# Altium schematic sheet MCU_LORA.SchDoc
size A3; SheetNumber: 1; SheetTotal: 1
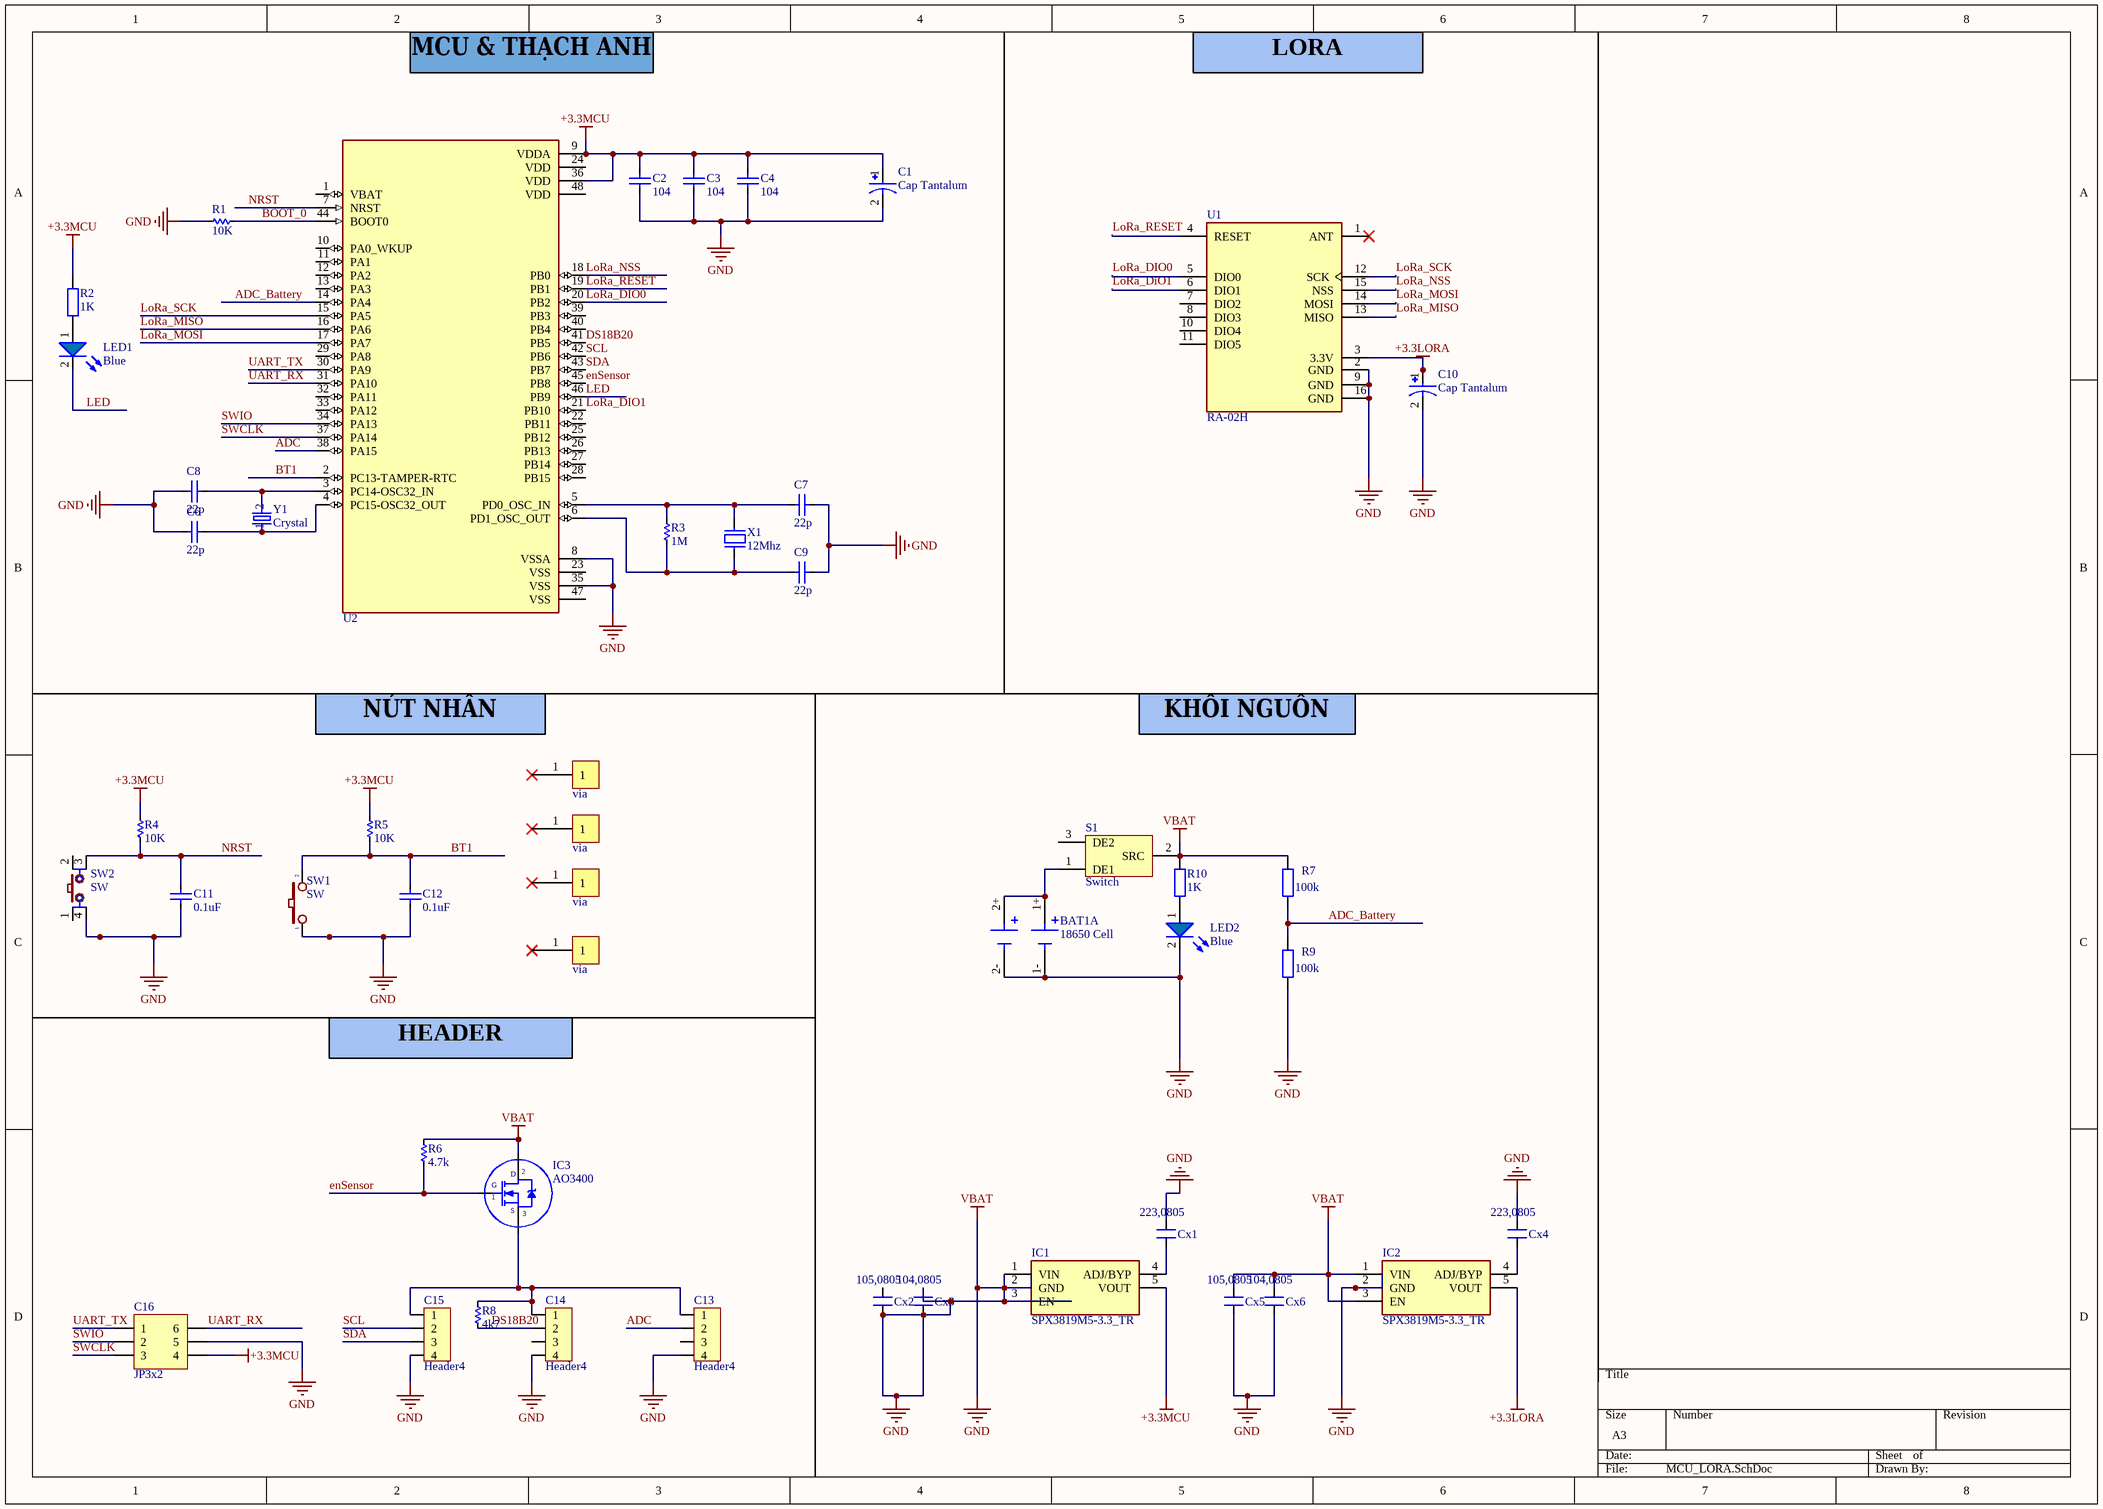
[diagram p0: MCU_LORA.SchDoc]

## Parts
BAT1  18650 Cell  [BAT_BK-18650-PC4]  (part A of 2)
C1  Cap Tantalum  [TANTALUM 3528]
C2  104  [CAP_0805]
C3  104  [CAP_0805]
C4  104  [CAP_0805]
C6  22p  [CAP_0805]
C7  22p  [CAP_0805]
C8  22p  [CAP_0805]
C9  22p  [CAP_0805]
C10  Cap Tantalum  [TANTALUM 3528]
C11  0.1uF  [CAP_0805]
C12  0.1uF  [CAP_0805]
C13  Header4  [Header4]
C14  Header4  [Header4]
C15  Header4  [Header4]
C16  JP3x2  [JP3-D2T]
Cx1  223,0805  [CN-SMD-0805]
Cx2  105,0805  [CN-SMD-0805]
Cx3  104,0805  [CN-SMD-0805]
Cx4  223,0805  [CN-SMD-0805]
Cx5  105,0805  [CN-SMD-0805]
Cx6  104,0805  [CN-SMD-0805]
IC1  SPX3819M5-3.3_TR  [SOT95P280X145-5N]
IC2  SPX3819M5-3.3_TR  [SOT95P280X145-5N]
IC3  AO3400  [SOT23A]
LED1  value Blue  [LED-0805-Blue]  (hidden comment: LED-Blue)
LED2  value Blue  [LED-0805-Blue]  (hidden comment: LED-Blue)
R1  10K  [RES-SMD-0805]
R2  1K  [RES-SMD-0805]
R3  1M  [RES-SMD-0805]
R4  10K  [RES-SMD-0805]
R5  10K  [RES-SMD-0805]
R6  4.7k  [RES-SMD-0805]
R7  100k  [RES-SMD-0805]
R8  4k7  [RES-SMD-0805]
R9  100k  [RES-SMD-0805]
R10  1K  [RES-SMD-0805]
S1  Switch  [Switch]
SW1  SW  [SW1-DIP]
SW2  SW  [SW2-DIP]
U1  RA-02H  [LoRa-02]
U2  STM32  [LQFP 48]  (value not drawn)
via1  via  [via]
via2  via  [via]
via3  via  [via]
via4  via  [via]
X1  12Mhz  [XT2]
Y1  Crystal  [Crystal 32.768]

## Nets
+3.3LORA: C10.1 IC2.5(VOUT) U1.3(3.3V)
+3.3MCU: C1.1 C2.2 C3.2 C4.2 C16.4 IC1.5(VOUT) R2.1 R4.1 R5.1 U2.9(VDDA) U2.36(VDD)
GND: BAT1.1- BAT1.2- C1.2 C2.1 C3.1 C4.1 C6.1 C7.1 C8.1 C9.2 C10.2 C11.1 C12.1 C13.4 C14.4 C15.4 C16.5 Cx1.2 Cx2.1 Cx3.1 Cx3.2 Cx4.2 Cx5.1 Cx5.2 Cx6.1 Cx6.2 IC1.1(VIN) IC1.2(GND) IC1.3(EN) IC2.1(VIN) IC2.2(GND) IC2.3(EN) IC3.2(D) LED2.2(K) R1.1 R6.1 R7.2 R9.1 R10.1 S1.2(SRC) SW1.1 SW2.4 U1.2(GND) U1.9(GND) U1.16(GND) U2.8(VSSA) U2.35(VSS)  [also labelled VBAT]
ADC: C13.2 U2.38(PA15)
ADC_Battery: R7.1 R9.2 U2.14(PA4)
BOOT_0: R1.2 U2.44(BOOT0)
BT1: C12.2 R5.2 SW1.2 U2.2(PC13-TAMPER-RTC)
DS18B20: C14.2 R8.2 U2.41(PB5)
enSensor: IC3.1(G) R6.2 U2.45(PB8)
LED: LED1.2(K) U2.46(PB9)
LoRa_DIO0: U1.5(DIO0) U2.20(PB2)
LoRa_DiO1: U1.6(DIO1) U2.21(PB10)
LoRa_MISO: U1.13(MISO) U2.16(PA6)
LoRa_MOSI: U1.14(MOSI) U2.17(PA7)
LoRa_NSS: U1.15(NSS) U2.18(PB0)
LoRa_RESET: U1.4(RESET) U2.19(PB1)
LoRa_SCK: U1.12(SCK) U2.15(PA5)
NRST: C11.2 R4.2 SW2.3 U2.7(NRST)
SCL: C15.2 U2.42(PB6)
SDA: C15.3 U2.43(PB7)
SWCLK: C16.3 U2.37(PA14)
SWIO: C16.2 U2.34(PA13)
UART_RX: C16.6 U2.31(PA10)
UART_TX: C16.1 U2.30(PA9)
NetBAT1_1+: BAT1.1+ BAT1.2+ S1.1(DE1)
NetC6_2: C6.2 U2.4(PC15-OSC32_OUT) Y1.1
NetC7_2: C7.2 R3.1 U2.5(PD0_OSC_IN) X1.2
NetC8_2: C8.2 U2.3(PC14-OSC32_IN) Y1.4
NetC9_1: C9.1 R3.2 U2.6(PD1_OSC_OUT) X1.1
NetC13_1: C13.1 C14.1 C15.1 IC3.3(S) R8.1
NetCx1_1: Cx1.1 IC1.4(ADJ/BYP)
NetCx4_1: Cx4.1 IC2.4(ADJ/BYP)
NetLED1_1: LED1.1(A) R2.2
NetLED2_1: LED2.1(A) R10.2

Not connected (* = marked no-connect by the designer): C13 3; C14 3; Cx2 2; S1 3(DE2) 4 5; SW2 1 2; U1 1(ANT)* 7(DIO2) 8(DIO3) 10(DIO4) 11(DIO5); U2 1(VBAT) 10(PA0_WKUP) 11(PA1) 12(PA2) 13(PA3) 22(PB11) 23(VSS) 24(VDD) 25(PB12) 26(PB13) 27(PB14) 28(PB15) 29(PA8) 32(PA11) 33(PA12) 39(PB3) 40(PB4) 47(VSS) 48(VDD); via1 1*; via2 1*; via3 1*; via4 1*

## Notes on the sheet
- MCU & THẠCH ANH
- LORA
- (near via1) NÚT NHẤN
- KHỐI NGUỒN
- HEADER

## Library data of the parts
BAT1 = 18650 Cell: Battery Holder (Open) 18650 2 Cell PC Pin; MP: BK-18650-PC4; Price: None; Value: *; Package: None; Availability: Unavailable
C1 C10 = Cap Tantalum: Capacitor, Tantalum; MP: T493C106K020BH6310; MF: Kemet; Availability: In Stock; Price: None; Package: SMD-2 Kemet; Value: *; SnapEDA_Link: https://www.snapeda.com/parts/T493C106K020BH6310/Kemet/view-part/?ref=snap; Check_prices: https://www.snapeda.com/parts/T493C106K020BH6310/Kemet/view-part/?ref=eda
C2-C4 C6-C9 C11 C12 = CapSMD: Capacitor; Value: 33p; Published: 8-Jun-2000; LatestRevisionDate: 17-Jul-2002; LatestRevisionNote: Re-released for DXP Platform.; PackageReference: RAD-0.3; Publisher: Altium Limited
C13-C15 = Header4: Header IDC, 4 x 1 Pin Vertical 2.54mm Pitch (Non-Boxed, Male); Manufacturer: W¨¹rth Elektronik eiSos GmbH; partNo: 613002143121; ComponentLink1 Description: Manufacturer; ComponentLink2 Description: Datasheet; NoPins: 02; Created Date: 29 March 2013; ComponentLink1URL: http://www.we-online.com; ComponentLink2URL: http://katalog.we-online.de/em/datasheet/6130xx143121.pdf; Created by: Karrer Zheng
C16 = JP3x2: WR-PHD 2.54 mm Dual Socket Header; Manufacturer: W¨¹rth Elektronik eiSos GmbH; partNo: 61300621821; ComponentLink1 Description: Manufacturer; ComponentLink2 Description: Datasheet; NoPins: 06; Created Date: 29 March 2013; ComponentLink1URL: http://www.we-online.com; ComponentLink2URL: http://katalog.we-online.de/em/datasheet/6130xx21821.pdf; Created by: Karrer Zheng
Cx1-Cx6 = CN: Value: 33pF
IC1 IC2 = SPX3819M5-3.3_TR: Integrated Circuit; Manufacturer_Name: MaxLinear; Manufacturer_Part_Number: SPX3819M5-3.3/TR; Datasheet Link: https://assets.maxlinear.com/web/documents/spx3819.pdf; Height: 1.45mm
IC3 = MOSFET_N: Generic N Channel MOSFET
LED1 LED2 = LED-Blue: LED Blue 10mA 2.2v; ComponentLink1Description: Datasheet; ComponentLink1URL: D:\Dropbox\Datasheets\Opto and Illumination\LEDs\SMD LED.pdf; Unit Price: 0.0476
R1 R3-R6 R8 = Res-SMD: Resistor; Manufacturer: Generic Components; Class: Passive; Published: 08/06/2000; Publisher: Altium Hobart Technology Centre
R2 R7 R9 R10 = Resistor - SMD: Resistor SMD; Manufacturer: Generic Components; Class: Passive; Published: 08/06/2000; Publisher: Altium Hobart Technology Centre
SW1 = SW2: Switch button 2 pin; Value: SW chip 2 pin
SW2 = SW4: Switch button 4 pin; Value: Button chip 4 pin
U1 = RA-02H: Ai-Thinker Lora Series Module; MP: RA-01H; SnapEDA_Link: https://www.snapeda.com/parts/RA-01H/AI-Thinker/view-part/?ref=snap; MF: AI-Thinker; Check_prices: https://www.snapeda.com/parts/RA-01H/AI-Thinker/view-part/?ref=eda; Value: *; Availability: Not in stock; Price: None; Package: Package
U2 = STM32F103C8T6: STM32 ARM-based 32-bit MCU with 64 Kbytes Flash, 64-pin LQFP, Industrial Temperature
via1-via4 = Vit oc
X1 = XT2: Crystal, 32.768 KHz, -40 to 85 degC, 3.2 x 1.5 x 0.9 mm SMD; Value: 4Mhz
Y1 = Crystal: 32.768 kHz; MF: Abracon; MP: ABS25-32.768KHZ-6-1-T; Package: 4-4 Abracon; Value: *; Check_prices: https://www.snapeda.com/parts/ABS25-32.768KHZ-6-1-T/Abracon+LLC/view-part/?ref=eda; SnapEDA_Link: https://www.snapeda.com/parts/ABS25-32.768KHZ-6-1-T/Abracon+LLC/view-part/?ref=snap; Availability: In Stock; Purchase-URL: https://pricing.snapeda.com/search/part/ABS25-32.768KHZ-6-1-T/?ref=eda; Price: None